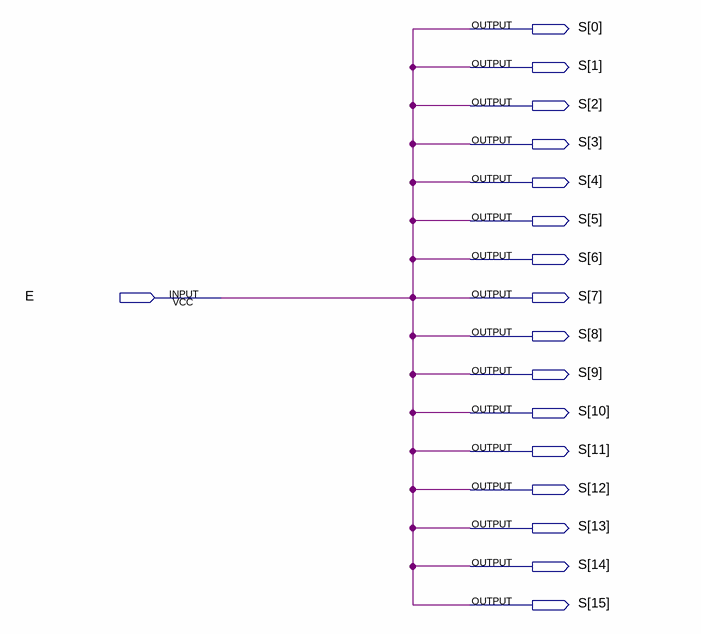
[diagram p0: schematic sheet]
// Quartus schematic Replicator16.bdf as structural Verilog: 0 symbols, 17 pins
module Replicator16 (
  input  E,
  output [15:0] S
);


  assign S = {16{E}};
endmodule
